# Altium project Morpheus_pill.PrjPcb
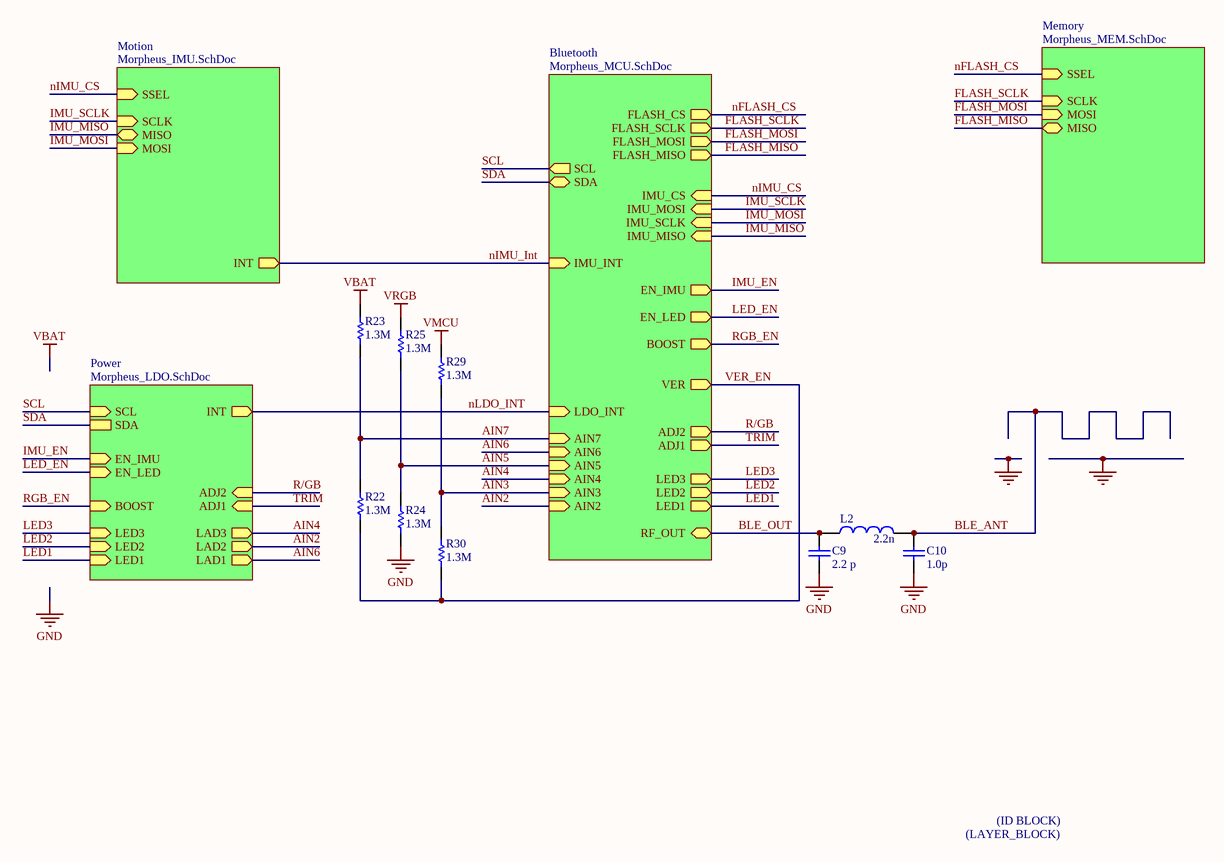
[diagram p0: Morpheus_pill.SchDoc]
5 sheets, 69 parts. Net scope: hierarchical (ports join the sheet entries above them; power ports are global).
Board file: Morpheus_pill.PcbDoc
Sheets:
  Morpheus_pill.SchDoc
    Bluetooth = Morpheus_MCU.SchDoc
    Memory = Morpheus_MEM.SchDoc
    Motion = Morpheus_IMU.SchDoc
    Power = Morpheus_LDO.SchDoc

## Sheet Morpheus_pill.SchDoc: Pill
size Letter; DrawnBy: Dyke Shaffer; Organization: Hello Inc.; Revision: EVT2; SheetNumber: 1; SheetTotal: 4

### Parts
*  LAYER_BLOCK  [Layer Stackup]  (value not drawn)  (no BOM)
C9  2.2 p  [CAP0402]
C10  1.0p  [CAP0402]
ID1  ID_BLOCK  [Hello Band]  (value not drawn)  (no BOM)
L2  2.2n  [IND_0402]
R22  1.3M  [RES0402]
R23  1.3M  [RES0402]
R24  1.3M  [RES0402]
R25  1.3M  [RES0402]
R29  1.3M  [RES0402]
R30  1.3M  [RES0402]

### Sub-sheets
Bluetooth = Morpheus_MCU.SchDoc: FLASH_SCLK (out), FLASH_CS (out), IMU_INT (in), LED3 (out), EN_IMU (out), AIN6 (in), LDO_INT (in), SCL (out), SDA, AIN7 (in), EN_LED (out), AIN4 (in), AIN5 (in), AIN2 (in), AIN3 (in), RF_OUT, ADJ2 (out), ADJ1 (out), LED2 (out), LED1 (out), BOOST (out), VER (out), IMU_MISO (in), IMU_SCLK (in), IMU_MOSI (in), IMU_CS (in), FLASH_MOSI (out), FLASH_MISO (out)
Memory = Morpheus_MEM.SchDoc: SSEL (in), MOSI (in), MISO, SCLK (in)
Motion = Morpheus_IMU.SchDoc: MOSI (in), MISO, SCLK (in), INT (out), SSEL (in)
Power = Morpheus_LDO.SchDoc: SDA, INT (out), SCL (in), LAD3 (out), LAD2 (out), LAD1 (out), ADJ2 (in), EN_LED (in), EN_IMU (in), BOOST (in), ADJ1 (in), LED3 (in), LED2 (in), LED1 (in)

### Nets
GND: C9.2 C10.2 R24.1
VBAT: R23.2
VMCU: R29.2
VRGB: R25.2
AIN2: sheet Bluetooth/AIN2, sheet Power/LAD2
AIN3: R29.1 R30.2 ; sheet Bluetooth/AIN3
AIN4: sheet Bluetooth/AIN4, sheet Power/LAD3
AIN5: R24.2 R25.1 ; sheet Bluetooth/AIN5
AIN6: sheet Bluetooth/AIN6, sheet Power/LAD1
AIN7: R22.2 R23.1 ; sheet Bluetooth/AIN7
BLE_ANT: C10.1 L2.2
BLE_OUT: C9.1 L2.1 ; sheet Bluetooth/RF_OUT
FLASH_MISO: sheet Bluetooth/FLASH_MISO, sheet Memory/MISO
FLASH_MOSI: sheet Bluetooth/FLASH_MOSI, sheet Memory/MOSI
FLASH_SCLK: sheet Bluetooth/FLASH_SCLK, sheet Memory/SCLK
IMU_EN: sheet Bluetooth/EN_IMU, sheet Power/EN_IMU
IMU_MISO: sheet Bluetooth/IMU_MISO, sheet Motion/MISO
IMU_MOSI: sheet Bluetooth/IMU_SCLK, sheet Motion/MOSI
IMU_SCLK: sheet Bluetooth/IMU_MOSI, sheet Motion/SCLK
LED1: sheet Bluetooth/LED1, sheet Power/LED1
LED2: sheet Bluetooth/LED2, sheet Power/LED2
LED3: sheet Bluetooth/LED3, sheet Power/LED3
LED_EN: sheet Bluetooth/EN_LED, sheet Power/EN_LED
nFLASH_CS: sheet Bluetooth/FLASH_CS, sheet Memory/SSEL
nIMU_CS: sheet Bluetooth/IMU_CS, sheet Motion/SSEL
nIMU_Int: sheet Bluetooth/IMU_INT, sheet Motion/INT
nLDO_INT: sheet Bluetooth/LDO_INT, sheet Power/INT
R/GB: sheet Bluetooth/ADJ2, sheet Power/ADJ2
RGB_EN: sheet Bluetooth/BOOST, sheet Power/BOOST
SCL: sheet Bluetooth/SCL, sheet Power/SCL
SDA: sheet Bluetooth/SDA, sheet Power/SDA
TRIM: sheet Bluetooth/ADJ1, sheet Power/ADJ1
VER_EN: R22.1 R30.1 ; sheet Bluetooth/VER

### Notes on the sheet
- TITLE
- DATE
- DRAWN BY
- REV
- SHEET
- OF
- (in symbol ID_BLOCK) (ID BLOCK)
- (in symbol LAYER_BLOCK) (LAYER_BLOCK)

### Library data of the parts
C9 = C_2.2p_0.05_50_C0G_0402: Chip capacitor; Vendor: Murata; PN: GRM1555C1H2R2WA01D; Tolerance: 0.05; Voltage: 50 V; Temp: C0G; Value: 2.2 p; Size: 0402
C10 = C_2200p_5_16_STD_0402: Chip capacitor; Vendor: Taiyo Yuden; PN: EMK100SD222JV-F; Tolerance: 5 %; Voltage: 16V; Temp: Standard; Value: 1.0p; Size: 0402
L2 = L_2.2n_0.1_?_0.150_0.9_?: SMD power inductor, 2.2uH; PN: MLG1005S2N2BT000; Vendor: TDK; Tolerance: 0.1; RDC: 0.150; I_max: 0.9; Value: 2.2n; Q: ?; I_sat: ?
R22-R25 R29 R30 = R_1.3M_5_0.1_0402_1: Chip Resistor; Vendor: Panasonic; Tolerance: 5 %; Power: 0.1 W; PN: ERJ-2GEJ135X; Model: *; Value: 1.3M; Size: 0402

## Sheet Morpheus_MCU.SchDoc: BLE MCU
size Letter; Author: Dyke Shaffer; CompanyName: Hello, Inc.; Engineer: Dyke Shaffer; Organization: Hello, Inc.; Revision: EVT2; SheetNumber: 4; SheetTotal: 4; ProjectName: Hello Band
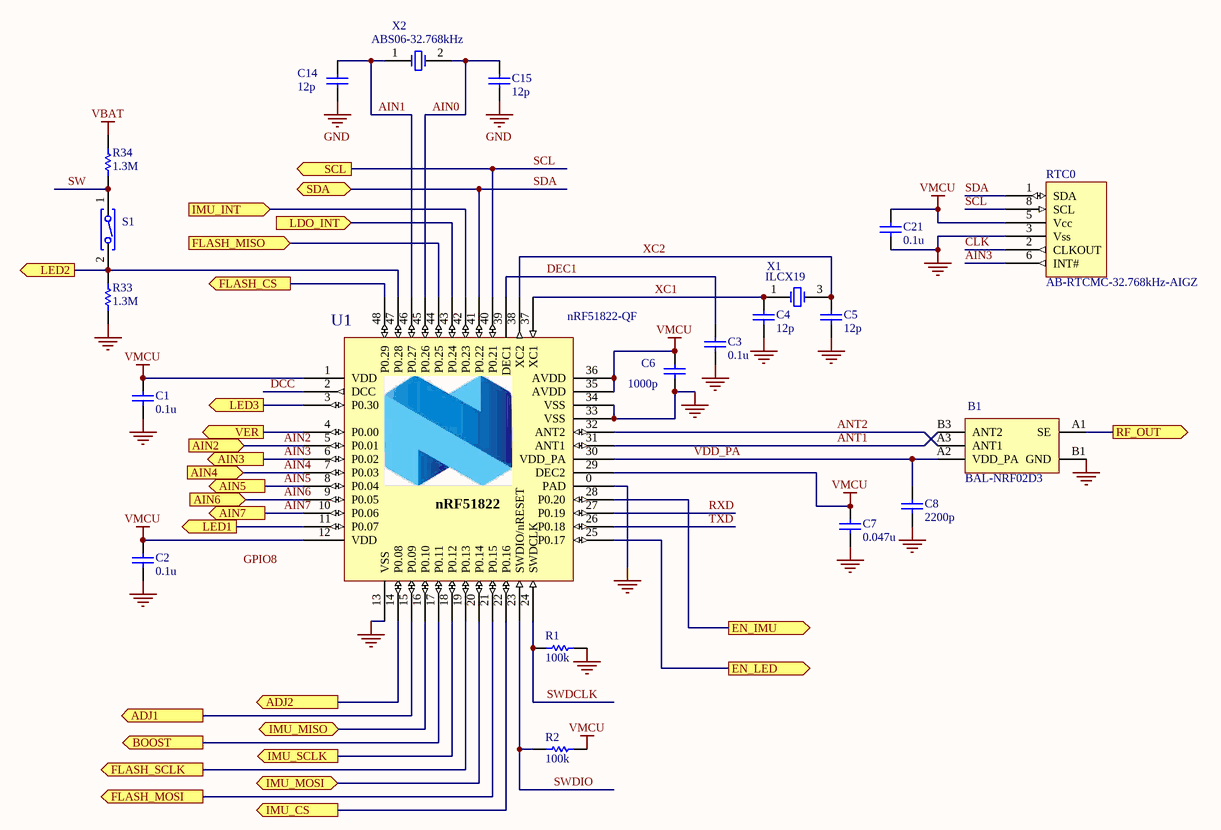
[diagram p1: Morpheus_MCU.SchDoc]

### Parts
B1  BAL-NRF02D3  [BAL-ST-WLCSP]
C1  0.1u  [CAP0402]
C2  0.1u  [CAP0402]
C3  0.1u  [CAP0402]
C4  12p  [CAP0402]
C5  12p  [CAP0402]
C6  1000p  [CAP0402]
C7  0.047u  [CAP0402]
C8  2200p  [CAP0402]
C14  12p  [CAP0402]
C15  12p  [CAP0402]
C21  0.1u  [CAP0402]
R1  100k  [RES0402]
R2  100k  [RES0402]
R33  1.3M  [RES0402]
R34  1.3M  [RES0402]
RTC0  AB-RTCMC-32.768kHz-AIGZ  [8-CLCC]
S1  REED_SPST_NO  [REED-10x1.8]  (value not drawn)
U1  nRF51822-QF  [VQFN40P600X600X100-48]
X1  ILCX19  [ILCX19]
X2  ABS06-32.768kHz  [ABS06]

### Ports
ADJ1 (out), ADJ2 (out), AIN2 (in), AIN3 (out), AIN4 (in), AIN5 (out), AIN6 (in), AIN7 (out), BOOST (out), EN_IMU (out), EN_LED (out), FLASH_CS (out), FLASH_MISO (in), FLASH_MOSI (out), FLASH_SCLK (out), IMU_CS (out), IMU_INT (in), IMU_MISO, IMU_MOSI, IMU_SCLK (out), LDO_INT (in), LED1 (out), LED2 (out), LED3 (out), RF_OUT (out), SCL (out), SDA, VER (out)

### Nets
GND: B1.B1(GND) C1.1 C2.1 C3.1 C4.1 C5.1 C6.1 C7.1 C8.1 C14.1 C15.1 C21.1 R1.2 R33.1 RTC0.3(Vss) U1.0(PAD) U1.13(VSS) U1.33(VSS) U1.34(VSS)
VBAT: R34.2
VMCU: C1.2 C2.2 C6.2 C7.2 C21.2 R2.2 RTC0.5(Vcc) U1.1(VDD) U1.12(VDD) U1.29(DEC2) U1.35(AVDD) U1.36(AVDD)
AIN0: C15.2 U1.45(P0.26) X2.2
AIN1: C14.2 U1.46(P0.27) X2.1
AIN2: U1.5(P0.01) ; port AIN2
AIN3: RTC0.6(INT#) U1.6(P0.02) ; port AIN3
AIN4: U1.7(P0.03) ; port AIN4
AIN5: U1.8(P0.04) ; port AIN5
AIN6: U1.9(P0.05) ; port AIN6
AIN7: U1.10(P0.06) ; port AIN7
ANT1: B1.B3(ANT2) U1.31(ANT1)
ANT2: B1.A3(ANT1) U1.32(ANT2)
BLE_OUT: B1.A1(SE) ; port RF_OUT
CLK: RTC0.2(CLKOUT)
DCC: U1.2(DCC)
DEC1: C3.2 U1.39(DEC1)
FLASH_MISO: U1.44(P0.25) ; port FLASH_MISO
FLASH_MOSI: U1.21(P0.15) ; port FLASH_MOSI
FLASH_SCLK: U1.19(P0.13) ; port FLASH_SCLK
IMU_EN: U1.28(P0.20) ; port EN_IMU
IMU_MISO: U1.16(P0.10) ; port IMU_MISO
IMU_MOSI: U1.18(P0.12) ; port IMU_SCLK
IMU_SCLK: U1.20(P0.14) ; port IMU_MOSI
LED1: U1.11(P0.07) ; port LED1
LED2: R33.2 S1.2 U1.47(P0.28) ; port LED2
LED3: U1.3(P0.30) ; port LED3
LED_EN: U1.25(P0.17) ; port EN_LED
nFLASH_CS: U1.48(P0.29) ; port FLASH_CS
nIMU_CS: U1.22(P0.16) ; port IMU_CS
nIMU_Int: U1.42(P0.23) ; port IMU_INT
nLDO_INT: U1.43(P0.24) ; port LDO_INT
R/GB: U1.14(P0.08) ; port ADJ2
RGB_EN: U1.17(P0.11) ; port BOOST
RXD: U1.27(P0.19)
SCL: RTC0.8(SCL) U1.40(P0.21) ; port SCL
SDA: RTC0.1(SDA) U1.41(P0.22) ; port SDA
SW: R34.1 S1.1
SWDCLK: R1.1 U1.24(SWDCLK)
SWDIO: R2.1 U1.23(SWDIO/nRESET)
TRIM: U1.15(P0.09) ; port ADJ1
TXD: U1.26(P0.18)
VDD_PA: B1.A2(VDD_PA) C8.2 U1.30(VDD_PA)
VER_EN: U1.4(P0.00) ; port VER
XC1: C4.2 U1.37(XC1) X1.1(XTAL1)
XC2: C5.2 U1.38(XC2) X1.3(XTAL2)

Not connected (* = marked no-connect by the designer): RTC0 4(NC) 7(NC)

### Notes on the sheet
- Labels drawn without touching a wire or pin: GPIO8
- TITLE
- DATE
- DRAWN BY
- REV
- SHEET
- OF
- (in symbol nRF51822_QF) nRF51822

### Library data of the parts
B1 = BAL-ST-5pin_DC-Flip: 50 ohm balun transformer for 2.45GHz ISM; Manufacturer: ST; Artikkelnr Noca: N.A.; Part Number: BAL-NRF02D3; Manufacturer Part Number: BAL-NRF02D3; Datasheet: *; LatestRevisionDate: 2013-05-15; Pin Count: 5; Publisher: Nordic Semiconductor; Published: 2013-05-15; Value: BAL-NRF02D3; Note: BAL-NRF02D3; Supplier: *; Supplier part number: *; 2nd source Supplier: *; 2nd source part number: *
C1-C3 C21 = C_0.1u_10_50_X7R_0402: Chip capacitor; Vendor: Taiyo Yuden; PN: UMK105B7104KV-FR; Tolerance: 10%; Voltage: 50V; Temp: X7R; Value: 0.1u; Size: 0402
C4 C5 C14 C15 = C_27p_5_50_C0G_0402: Chip capacitor; Vendor: Murata; PN: GRM1535C1H120JDD5D; Tolerance: 5%; Voltage: 50V; Temp: C0G; Value: 12p; Size: 0402
C6 = C_1000p_10_50_X7R_0402: Chip capacitor; Vendor: Murata; PN: GRM155R71H102KA01D; Tolerance: 10%; Voltage: 50V; Temp: X7R; Value: 1000p; Size: 0402
C7 = C_0.047u_10_16_X7R_0402: Chip capacitor; Vendor: Taiyo Yuden; PN: EMK105B7473KV-F; Tolerance: 10%; Voltage: 16V; Temp: X7R; Value: 0.047u; Size: 0402
C8 = C_2200p_5_16_STD_0402: Chip capacitor; Vendor: Taiyo Yuden; PN: EMK105SD222JV-F; Tolerance: 5 %; Voltage: 16V; Temp: Standard; Value: 2200p; Size: 0402
R1 R2 = R_100k_1_0.1_0402: Chip Resistor; Vendor: Panasonic; Tolerance: 1 %; Power: 0.1 W; PN: ERJ-2RKF1003X; Model: *; Value: 100k; Size: 0402
R33 R34 = R_1.3M_5_0.1_0402_1: as R22 on sheet Morpheus_pill; Model: *; Value: 1.3M; Size: 0402
RTC0 = AB-RTCMC-32.768kHz-AIGZ: Abracon I2C RTC w/ integrated XO
S1 = SW_REED_SPST_NO: SWITCH REED SPST NO
U1 = nRF51822_QF: Multi-protocol Bluetooth Low Energy and 2.4GHz proprietary system-on-chip; Manufacturer: Nordic Semiconductor; Note: nRF51822 - VQFN48 6x6 0.4mm pitch; Artikkelnr Noca: N.A.; Part Number: nRF51822-QF; Manufacturer Part Number: nRF51822-QF; Datasheet: *; Footprint: VQFN48; LatestRevisionDate: 2013-04-10; Pin Count: 48; Publisher: Nordic Semiconductor; Published: 2012-06-12; Value: nRF51822-QF; Supplier: Nordic Semiconductor; Supplier part number: *; 2nd source Supplier: *; 2nd source part number: *
X1 = ILCX19: ILSI ILCX19 Crystal Oscillator
X2 = ABS06: Abracon ABS06 32.768kHz XO 2.0x1.2x0.6mm; Vendor: Abracon; Value: 32.768kHz

## Sheet Morpheus_MEM.SchDoc: Storage Sub-board
size Letter; CompanyName: Hello Inc.; DrawnBy: John Kelley; Organization: Hello Inc.; Revision: EVT2; SheetNumber: 7; SheetTotal: 8
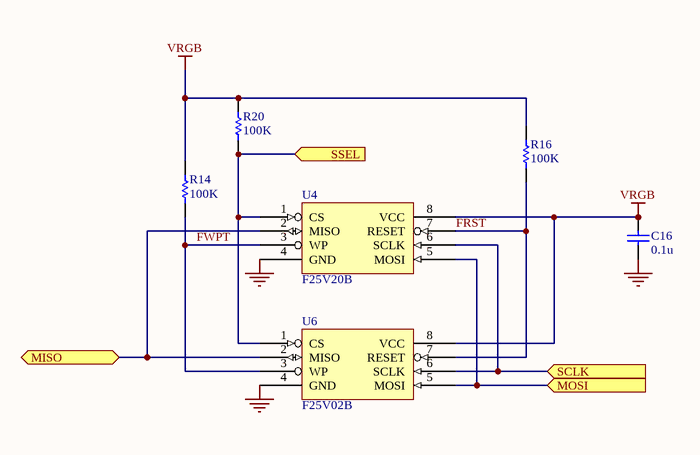
[diagram p2: Morpheus_MEM.SchDoc]

### Parts
C16  0.1u  [CAP0402]
R14  100K  [RES0402]
R16  100K  [RES0402]
R20  100K  [RES0402]
U4  F25V20B  [DFN127P600x500x80-8N]
U6  F25V02B  [DFN95P5000x4500x80-8N]

### Ports
MISO, MOSI (in), SCLK (in), SSEL (in)

### Nets
GND: C16.1 U4.4(GND) U6.4(GND)
VRGB: C16.2 R14.2 R16.2 R20.2 U4.8(VCC) U6.8(VCC)
FLASH_MISO: U4.2(MISO) U6.2(MISO) ; port MISO
FLASH_MOSI: U4.5(MOSI) U6.5(MOSI) ; port MOSI
FLASH_SCLK: U4.6(SCLK) U6.6(SCLK) ; port SCLK
FRST: R16.1 U4.7(RESET) U6.7(RESET)
FWPT: R14.1 U4.3(WP) U6.3(WP)
nFLASH_CS: R20.1 U4.1(CS) U6.1(CS) ; port SSEL

### Notes on the sheet
- TITLE
- DATE
- DRAWN BY
- REV
- SHEET
- OF

### Library data of the parts
C16 = C_0.1u_10_50_X7R_0402: as C1 on sheet Morpheus_MCU; Value: 0.1u; Size: 0402
R14 R16 R20 = R_100K_5_0.1_0402: Chip Resistor; Vendor: Panasonic; Tolerance: 5 %; Power: 0.1 W; PN: ERJ-2GEJ104X; Model: *; Value: 100K; Size: 0402
U4 = FM25V20B: Cypress SPI FRAM 256Kx8
U6 = FM25V02B: Cypress SPI FRAM 32Kx8

## Sheet Morpheus_IMU.SchDoc: IMU
size Letter; CompanyName: Hello Inc.; DrawnBy: Dyke Shaffer; Organization: Hello Inc.; Revision: EVT2; SheetNumber: 3; SheetTotal: 4
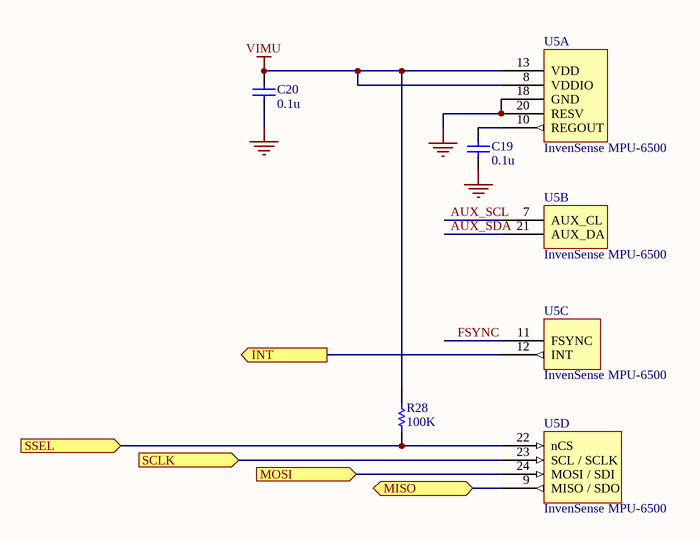
[diagram p3: Morpheus_IMU.SchDoc]

### Parts
C19  0.1u  [CAP0402]
C20  0.1u  [CAP0402]
R28  100K  [RES0402]
U5  InvenSense MPU-6500  [QFN-24]  (parts A,B,C,D of 4)

### Ports
INT (out), MISO, MOSI (in), SCLK (in), SSEL (in)

### Nets
GND: C19.1 C20.1 U5.18(GND) U5.20(RESV)
VIMU: C20.2 R28.2 U5.8(VDDIO) U5.13(VDD)
AUX_SCL: U5.7(AUX_CL)
AUX_SDA: U5.21(AUX_DA)
FSYNC: U5.11(FSYNC)
IMU_MISO: U5.9(MISO_/_SDO) ; port MISO
IMU_MOSI: U5.24(MOSI_/_SDI) ; port MOSI
IMU_SCLK: U5.23(SCL_/_SCLK) ; port SCLK
nIMU_CS: R28.1 U5.22(nCS) ; port SSEL
nIMU_Int: U5.12(INT) ; port INT
NetC19_2: C19.2 U5.10(REGOUT)

### Notes on the sheet
- TITLE
- DATE
- DRAWN BY
- REV
- SHEET
- OF

### Library data of the parts
C19 C20 = C_0.1u_10_50_X7R_0402: as C1 on sheet Morpheus_MCU; Value: 0.1u; Size: 0402
R28 = R_100K_5_0.1_0402: as R14 on sheet Morpheus_MEM; Model: *; Value: 100K; Size: 0402
U5 = MPU-6500: InvenSense MPU-6500 6-axis accelerometer and gyroscope

## Sheet Morpheus_LDO.SchDoc: Gas Gaugre with LDO
size Letter; CompanyName: Hello Inc.; DrawnBy: Dyke Shaffer; Organization: Hello Inc.; Revision: EVT2; SheetNumber: 2; SheetTotal: 4
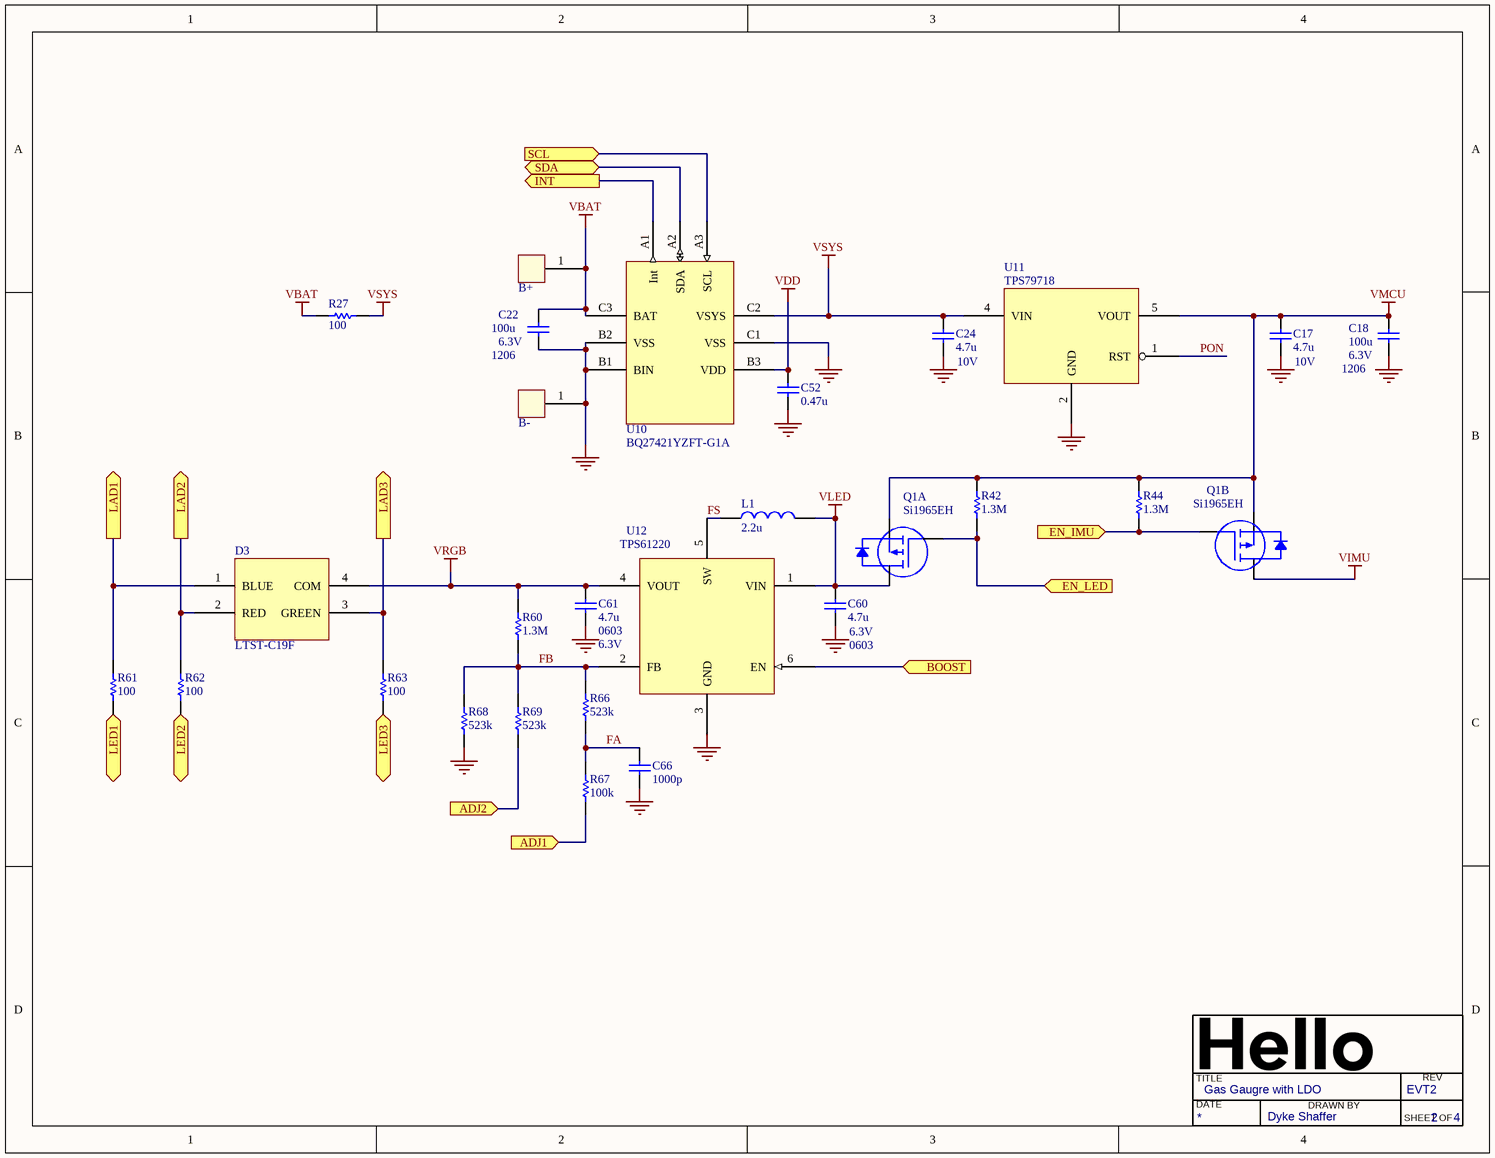
[diagram p4: Morpheus_LDO.SchDoc]

### Parts
B+  5016  [TP0875x050]  (value not drawn)
B-  5016  [TP0875x050]  (value not drawn)
C17  4.7u  Voltage: 10V  [CAP0402]
C18  100u  Size: 1206  Voltage: 6.3V  [CAP1206]
C22  100u  Size: 1206  Voltage: 6.3V  [CAP1206]
C24  4.7u  Voltage: 10V  [CAP0402]
C52  0.47u  [CAP0402]
C60  4.7u  Size: 0603  Voltage: 6.3V  [CAP0603]
C61  4.7u  Size: 0603  Voltage: 6.3V  [CAP0603]
C66  1000p  [CAP0402]
D3  LTST-C19F  [DFN165X210X160X80-4N]
L1  2.2u  [IND_1206]
Q1  Si1965EH  [SC-70-6]  (parts A,B of 2)
R27  100  [RES0402]
R42  1.3M  [RES0402]
R44  1.3M  [RES0402]
R60  1.3M  [RES0402]
R61  100  [RES0402]
R62  100  [RES0402]
R63  100  [RES0402]
R66  523k  [RES0402]
R67  100k  [RES0402]
R68  523k  [RES0402]
R69  523k  [RES0402]
U10  BQ27421YZFT-G1A  [BGA9C50P3X3_158X162X62]
U11  TPS79718  [SOT65P212X110-5N]
U12  TPS61220  [SOT65P212X110-6N]

### Ports
ADJ1 (in), ADJ2 (in), BOOST (in), EN_IMU (in), EN_LED (in), INT (out), LAD1 (out), LAD2 (out), LAD3 (out), LED1 (in), LED2 (in), LED3 (in), SCL (in), SDA

### Nets
GND: B-.1 C17.1 C18.1 C22.2 C24.1 C52.2 C60.1 C61.1 C66.1 R68.1 U10.B1(BIN) U10.B2(VSS) U10.C1(VSS) U11.2(GND) U12.3(GND)
VBAT: B+.1 C22.1 R27.2 U10.C3(BAT)
VDD: C52.1 U10.B3(VDD)
VIMU: Q1.3(D2)
VLED: C60.2 L1.1 Q1.6(D1) U12.1(VIN)
VMCU: C17.2 C18.2 Q1.1(S1) Q1.4(S2) R42.2 R44.2 U11.5(VOUT)
VRGB: C61.2 D3.4(COM) R60.2 U12.4(VOUT)
VSYS: C24.2 R27.1 U10.C2(VSYS) U11.4(VIN)
AIN2: D3.2(RED) R62.2 ; port LAD2
AIN4: D3.3(GREEN) R63.2 ; port LAD3
AIN6: D3.1(BLUE) R61.2 ; port LAD1
FA: C66.2 R66.1 R67.2
FB: R60.1 R66.2 R68.2 R69.2 U12.2(FB)
FS: L1.2 U12.5(SW)
IMU_EN: Q1.5(G2) R44.1 ; port EN_IMU
LED1: R61.1 ; port LED1
LED2: R62.1 ; port LED2
LED3: R63.1 ; port LED3
LED_EN: Q1.2(G1) R42.1 ; port EN_LED
nLDO_INT: U10.A1(Int) ; port INT
PON: U11.1(RST)
R/GB: R69.1 ; port ADJ2
RGB_EN: U12.6(EN) ; port BOOST
SCL: U10.A3(SCL) ; port SCL
SDA: U10.A2(SDA) ; port SDA
TRIM: R67.1 ; port ADJ1

### Notes on the sheet
- TITLE
- DATE
- DRAWN BY
- REV
- SHEET
- OF

### Library data of the parts
B+ B- = 5016: Single-pad test point
C17 C24 = C_4.7u_10_10_JB_0402: Chip capacitor; Vendor: TDK; PN: C1005JB1A475K050BC; Tolerance: 10%; Temp: JB; Value: 4.7u; Size: 0402
C18 C22 = C_100u_20_6.3_X5R_1206: Chip capacitor; Vendor: TDK; PN: C3216X5R0J107M160AB; Tolerance: 20%; Temp: X5R; Value: 100u
C52 = C_0.47u_10_10_X5R_0402: Chip capacitor; Vendor: TDK; PN: LMK105BJ474KV-F; Tolerance: 10%; Voltage: 10V; Temp: X5R; Value: 0.47u; Size: 0402
C60 C61 = C_4.7u_20_6.3_X5R_0603: Chip capacitor; Vendor: Murata; PN: GRM188R60J475ME19D; Tolerance: 20%; Temp: X5R; Value: 4.7u
C66 = C_1000p_10_50_X7R_0402: as C6 on sheet Morpheus_MCU; Value: 1000p; Size: 0402
D3 = LTST-C19F: RGB LED Array
L1 = L_2.2u_1206: SMD power inductor, 2.2uH; PN: LQM31PN2R2M00; Vendor: Murata; Tolerance: 20%; RDC: 0.19; I_max: 0.9; I_sat: 1.0; Value: 2.2u; Q: ?
Q1 = Si1965EH: Vishay Dual P-Channel MOSFET 1.8v drive 20V 1A; PN: Si1965EH; Vendor: Vishay
R27 R61-R63 = R_100_1_0.1_0402: Chip Resistor; Vendor: Panasonic; Tolerance: 1 %; Power: 0.1 W; PN: ERJ-2RKF1000X; Model: *; Value: 100; Size: 0402
R42 R44 R60 = R_1.3M_5_0.1_0402_1: as R22 on sheet Morpheus_pill; Model: *; Value: 1.3M; Size: 0402
R66 R68 R69 = R_523k_1_0.1_0402: Chip Resistor; Vendor: Panasonic; Tolerance: 1 %; Power: 0.1 W; PN: ERJ-2RKF5233X; Model: *; Value: 523k; Size: 0402
R67 = R_100k_1_0.1_0402: as R1 on sheet Morpheus_MCU; Model: *; Value: 100k; Size: 0402
U10 = BQ27421: TI Fuel Gauge With Integrated Sense Resistor
U11 = TPS79718DCK: LDO 1.8V SC70-5
U12 = TPS61220: Boost Converter

## Nets that join several sheets
GND: Morpheus_pill (C9.2 C10.2 R24.1), Morpheus_MCU (19 pins), Morpheus_MEM (C16.1 U4.4 U6.4), Morpheus_IMU (C19.1 C20.1 U5.18 U5.20), Morpheus_LDO (15 pins)
VBAT: Morpheus_pill (R23.2), Morpheus_MCU (R34.2), Morpheus_LDO (B+.1 C22.1 R27.2 U10.C3)
VIMU: Morpheus_IMU (C20.2 R28.2 U5.8 U5.13), Morpheus_LDO (Q1.3)
VMCU: Morpheus_pill (R29.2), Morpheus_MCU (12 pins), Morpheus_LDO (7 pins)
VRGB: Morpheus_pill (R25.2), Morpheus_MEM (6 pins), Morpheus_LDO (C61.2 D3.4 R60.2 U12.4)
AIN2: Morpheus_MCU (U1.5), Morpheus_LDO (D3.2 R62.2)
AIN3: Morpheus_pill (R29.1 R30.2), Morpheus_MCU (RTC0.6 U1.6)
AIN4: Morpheus_MCU (U1.7), Morpheus_LDO (D3.3 R63.2)
AIN5: Morpheus_pill (R24.2 R25.1), Morpheus_MCU (U1.8)
AIN6: Morpheus_MCU (U1.9), Morpheus_LDO (D3.1 R61.2)
AIN7: Morpheus_pill (R22.2 R23.1), Morpheus_MCU (U1.10)
BLE_OUT: Morpheus_pill (C9.1 L2.1), Morpheus_MCU (B1.A1)
FLASH_MISO: Morpheus_MCU (U1.44), Morpheus_MEM (U4.2 U6.2)
FLASH_MOSI: Morpheus_MCU (U1.21), Morpheus_MEM (U4.5 U6.5)
FLASH_SCLK: Morpheus_MCU (U1.19), Morpheus_MEM (U4.6 U6.6)
IMU_EN: Morpheus_MCU (U1.28), Morpheus_LDO (Q1.5 R44.1)
IMU_MISO: Morpheus_MCU (U1.16), Morpheus_IMU (U5.9)
IMU_MOSI: Morpheus_MCU (U1.18), Morpheus_IMU (U5.24)
IMU_SCLK: Morpheus_MCU (U1.20), Morpheus_IMU (U5.23)
LED1: Morpheus_MCU (U1.11), Morpheus_LDO (R61.1)
LED2: Morpheus_MCU (R33.2 S1.2 U1.47), Morpheus_LDO (R62.1)
LED3: Morpheus_MCU (U1.3), Morpheus_LDO (R63.1)
LED_EN: Morpheus_MCU (U1.25), Morpheus_LDO (Q1.2 R42.1)
nFLASH_CS: Morpheus_MCU (U1.48), Morpheus_MEM (R20.1 U4.1 U6.1)
nIMU_CS: Morpheus_MCU (U1.22), Morpheus_IMU (R28.1 U5.22)
nIMU_Int: Morpheus_MCU (U1.42), Morpheus_IMU (U5.12)
nLDO_INT: Morpheus_MCU (U1.43), Morpheus_LDO (U10.A1)
R/GB: Morpheus_MCU (U1.14), Morpheus_LDO (R69.1)
RGB_EN: Morpheus_MCU (U1.17), Morpheus_LDO (U12.6)
SCL: Morpheus_MCU (RTC0.8 U1.40), Morpheus_LDO (U10.A3)
SDA: Morpheus_MCU (RTC0.1 U1.41), Morpheus_LDO (U10.A2)
TRIM: Morpheus_MCU (U1.15), Morpheus_LDO (R67.1)
VER_EN: Morpheus_pill (R22.1 R30.1), Morpheus_MCU (U1.4)